# Altium project LCD_KB_Controller.PrjPcb
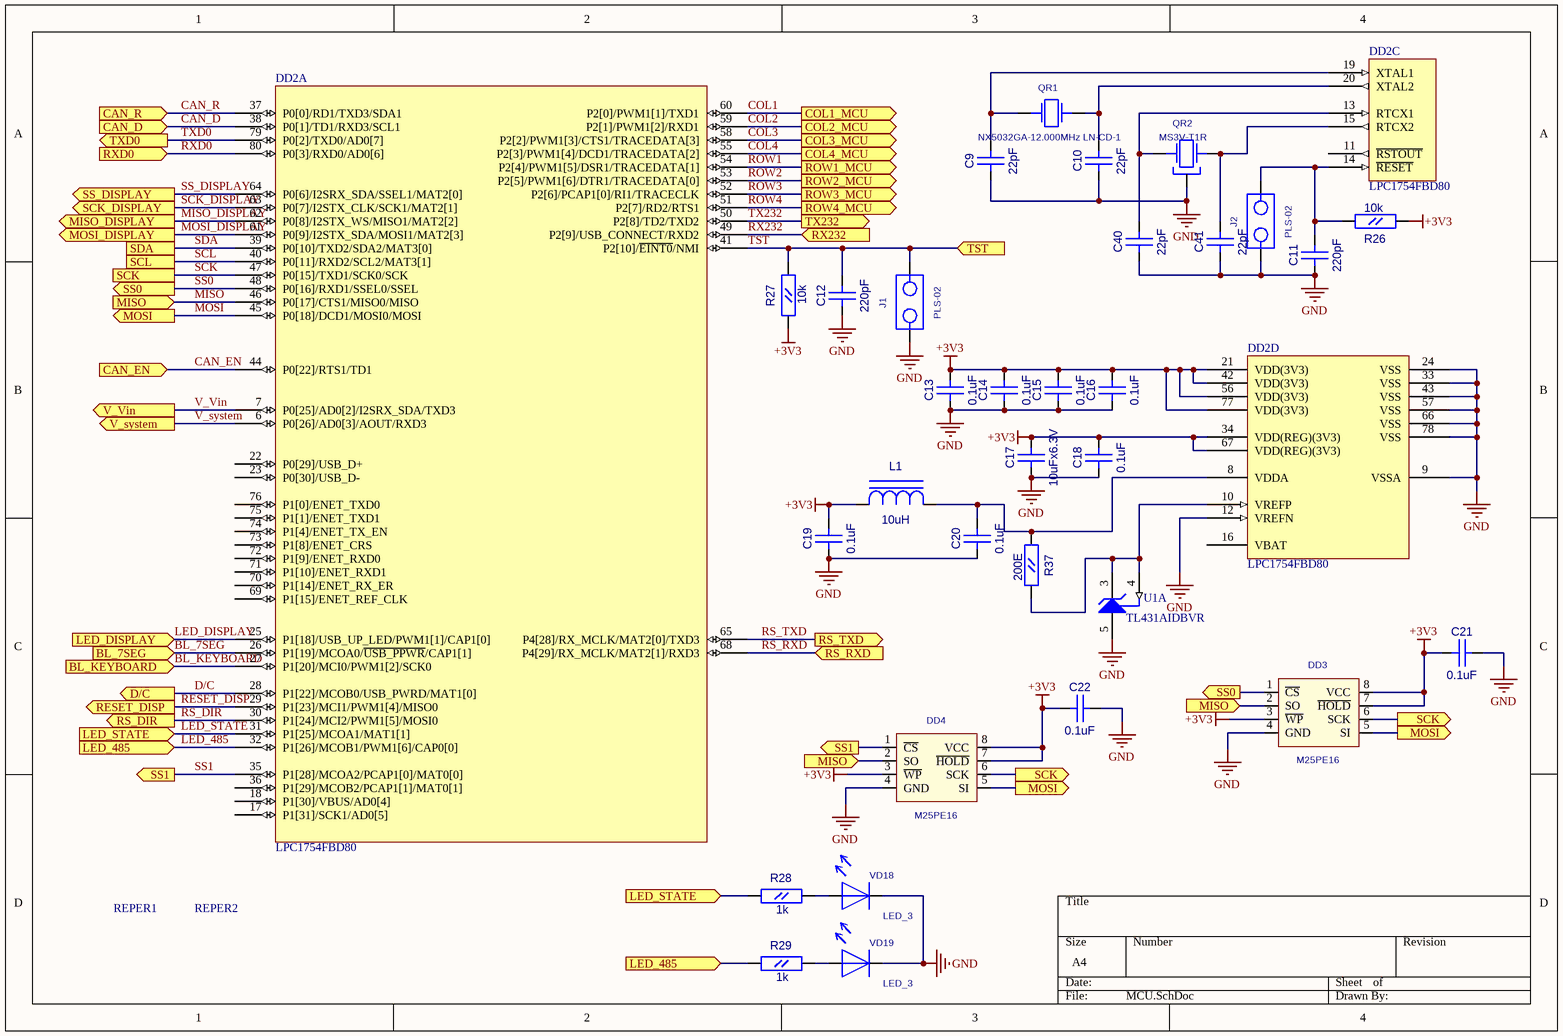
[diagram p0: MCU.SchDoc]
8 sheets, 131 parts. Net scope: flat (ports and power ports of the same name join across sheets).
Board file: LCD_KB_Controller.PcbDoc
Sheets:
  MCU.SchDoc
  Connection.SchDoc
  Power.SchDoc
  Battery.SchDoc
  CAN.SchDoc
  Keyboard.SchDoc
  RS485.SchDoc
  RS232.SchDoc

## Sheet MCU.SchDoc
size A4

### Parts
C9  22pF  [CC0603]
C10  22pF  [CC0603]
C11  220pF  [CC0603]
C12  220pF  [CC0603]
C13  0.1uF  [CC0603]
C14  0.1uF  [CC0603]
C15  0.1uF  [CC0603]
C16  0.1uF  [CC0603]
C17  10uFx6.3V  [CC0805]
C18  0.1uF  [CC0603]
C19  0.1uF  [CC0603]
C20  0.1uF  [CC0603]
C21  0.1uF  [CC0603]
C22  0.1uF  [CC0603]
C40  22pF  [CC0603]
C41  22pF  [CC0603]
DD2  LPC1754FBD80  [TQFP-80_0.5]  (parts A,C,D of 4)
DD3  M25PE16  [EIAJ_SO8]
DD4  M25PE16  [EIAJ_SO8]
J1  PLS-02  [PLS-02]
J2  PLS-02  [PLS-02]
L1  10uH  [L0603]
QR1  NX5032GA-12.000MHz LN-CD-1  [AC5032_2]
QR2  MS3V-T1R  [MS3V-T1R]
R26  10k  [RC0603]
R27  10k  [RC0603]
R28  1k  [RC0603]
R29  1k  [RC0603]
R37  200E  [RC0603]
REPER1  REPER1.2  [REPER1.2]  (value not drawn)
REPER2  REPER1.2  [REPER1.2]  (value not drawn)
U1  TL431AIDBVR  [TI-DBV5_N]  (part A of 2)
VD18  LED_3  [LED3]
VD19  LED_3  [LED3]

### Ports
BL_7SEG (in), BL_KEYBOARD (in), CAN_D (in), CAN_EN (in), CAN_R (in), COL1_MCU (out), COL2_MCU (out), COL3_MCU (out), COL4_MCU (out), D/C (out), LED_485 (in), LED_DISPLAY (in), LED_STATE (in), MISO (in), MISO_DISPLAY (out), MOSI (out), MOSI_DISPLAY (out), RESET_DISP (out), ROW1_MCU (out), ROW2_MCU (out), ROW3_MCU (out), ROW4_MCU (out), RS_DIR (out), RS_RXD (in), RS_TXD (out), RX232 (in), RXD0 (in), SCK, SCK (out), SCK_DISPLAY (out), SCL, SDA, SS0 (out), SS1 (out), SS_DISPLAY (out), TST (in), TX232 (out), TXD0 (out), V_system (out), V_Vin (out)

### Nets
+3V3: C13.2(B) C14.2(B) C15.2(B) C16.2(B) C17.2(B) C18.2(B) C19.2(B) C21.1(A) C22.1(A) DD2.21(VDD(3V3)) DD2.34(VDD(REG)(3V3)) DD2.42(VDD(3V3)) DD2.56(VDD(3V3)) DD2.67(VDD(REG)(3V3)) DD2.77(VDD(3V3)) DD3.3(~{WP}) DD3.7(~{HOLD}) DD3.8(VCC) DD4.3(~{WP}) DD4.7(~{HOLD}) DD4.8(VCC) L1.1(A) R26.1(A) R27.1(A)
GND: C9.1(A) C10.1(A) C11.1(A) C12.1(A) C13.1(A) C14.1(A) C15.1(A) C16.1(A) C17.1(A) C18.1(A) C19.1(A) C20.1(A) C21.2(B) C22.2(B) C40.1(A) C41.1(A) DD2.9(VSSA) DD2.12(VREFN) DD2.24(VSS) DD2.33(VSS) DD2.43(VSS) DD2.57(VSS) DD2.66(VSS) DD2.78(VSS) DD3.4(GND) DD4.4(GND) J1.1 J2.1 QR2.3 U1.5(ANODE) VD18.1 VD19.1
BL_7SEG: DD2.26(P1[19]/MCOA0/~{USB_PPWR}/CAP1[1]) ; port BL_7SEG
BL_KEYBOARD: DD2.27(P1[20]/MCI0/PWM1[2]/SCK0) ; port BL_KEYBOARD
CAN_D: DD2.38(P0[1]/TD1/RXD3/SCL1) ; port CAN_D
CAN_EN: DD2.44(P0[22]/RTS1/TD1) ; port CAN_EN
CAN_R: DD2.37(P0[0]/RD1/TXD3/SDA1) ; port CAN_R
COL1: DD2.60(P2[0]/PWM1[1]/TXD1) ; port COL1_MCU
COL2: DD2.59(P2[1]/PWM1[2]/RXD1) ; port COL2_MCU
COL3: DD2.58(P2[2]/PWM1[3]/CTS1/TRACEDATA[3]) ; port COL3_MCU
COL4: DD2.55(P2[3]/PWM1[4]/DCD1/TRACEDATA[2]) ; port COL4_MCU
D/C: DD2.28(P1[22]/MCOB0/USB_PWRD/MAT1[0]) ; port D/C
LED_485: DD2.32(P1[26]/MCOB1/PWM1[6]/CAP0[0]) R29.1(A) ; port LED_485
LED_DISPLAY: DD2.25(P1[18]/USB_UP_LED/PWM1[1]/CAP1[0]) ; port LED_DISPLAY
LED_STATE: DD2.31(P1[25]/MCOA1/MAT1[1]) R28.1(A) ; port LED_STATE
MISO: DD2.46(P0[17]/CTS1/MISO0/MISO) DD3.2(SO) DD4.2(SO) ; port MISO
MISO_DISPLAY: DD2.62(P0[8]/I2STX_WS/MISO1/MAT2[2]) ; port MISO_DISPLAY
MOSI: DD2.45(P0[18]/DCD1/MOSI0/MOSI) DD3.5(SI) DD4.5(SI) ; port MOSI
MOSI_DISPLAY: DD2.61(P0[9]/I2STX_SDA/MOSI1/MAT2[3]) ; port MOSI_DISPLAY
RESET_DISP: DD2.29(P1[23]/MCI1/PWM1[4]/MISO0) ; port RESET_DISP
ROW1: DD2.54(P2[4]/PWM1[5]/DSR1/TRACEDATA[1]) ; port ROW1_MCU
ROW2: DD2.53(P2[5]/PWM1[6]/DTR1/TRACEDATA[0]) ; port ROW2_MCU
ROW3: DD2.52(P2[6]/PCAP1[0]/RI1/TRACECLK) ; port ROW3_MCU
ROW4: DD2.51(P2[7]/RD2/RTS1) ; port ROW4_MCU
RS_DIR: DD2.30(P1[24]/MCI2/PWM1[5]/MOSI0) ; port RS_DIR
RS_RXD: DD2.68(P4[29]/RX_MCLK/MAT2[1]/RXD3) ; port RS_RXD
RS_TXD: DD2.65(P4[28]/RX_MCLK/MAT2[0]/TXD3) ; port RS_TXD
RX232: DD2.49(P2[9]/USB_CONNECT/RXD2) ; port RX232
RXD0: DD2.80(P0[3]/RXD0/AD0[6]) ; port RXD0
SCK: DD2.47(P0[15]/TXD1/SCK0/SCK) DD3.6(SCK) DD4.6(SCK) ; port SCK
SCK_DISPLAY: DD2.63(P0[7]/I2STX_CLK/SCK1/MAT2[1]) ; port SCK_DISPLAY
SCL: DD2.40(P0[11]/RXD2/SCL2/MAT3[1]) ; port SCL
SDA: DD2.39(P0[10]/TXD2/SDA2/MAT3[0]) ; port SDA
SS0: DD2.48(P0[16]/RXD1/SSEL0/SSEL) DD3.1(~{CS}) ; port SS0
SS1: DD2.35(P1[28]/MCOA2/PCAP1[0]/MAT0[0]) DD4.1(~{CS}) ; port SS1
SS_DISPLAY: DD2.64(P0[6]/I2SRX_SDA/SSEL1/MAT2[0]) ; port SS_DISPLAY
TST: C12.2(B) DD2.41(P2[10]/~{EINT0}/NMI) J1.2 R27.2(B) ; port TST
TX232: DD2.50(P2[8]/TD2/TXD2) ; port TX232
TXD0: DD2.79(P0[2]/TXD0/AD0[7]) ; port TXD0
V_system: DD2.6(P0[26]/AD0[3]/AOUT/RXD3) ; port V_system
V_Vin: DD2.7(P0[25]/AD0[2]/I2SRX_SDA/TXD3) ; port V_Vin
NetC9_2: C9.2(B) DD2.19(XTAL1) QR1.1
NetC10_2: C10.2(B) DD2.20(XTAL2) QR1.2
NetC11_2: C11.2(B) DD2.14(~{RESET}) J2.2 R26.2(B)
NetC20_2: C20.2(B) DD2.8(VDDA) L1.2(C) R37.1(A)
NetC40_2: C40.2(B) DD2.13(RTCX1) QR2.2(X2)
NetC41_2: C41.2(B) DD2.15(RTCX2) QR2.1(X1)
NetDD2_10: DD2.10(VREFP) R37.2(B) U1.3(CATHODE) U1.4(REF)
NetR28_2: R28.2(B) VD18.2
NetR29_2: R29.2(B) VD19.2

Not connected (* = marked no-connect by the designer): DD2 11(~{RSTOUT}) 16(VBAT) 17(P1[31]/SCK1/AD0[5]) 18(P1[30]/VBUS/AD0[4]) 22(P0[29]/USB_D+) 23(P0[30]/USB_D-) 36(P1[29]/MCOB2/PCAP1[1]/MAT0[1]) 69(P1[15]/ENET_REF_CLK) 70(P1[14]/ENET_RX_ER) 71(P1[10]/ENET_RXD1) 72(P1[9]/ENET_RXD0) 73(P1[8]/ENET_CRS) 74(P1[4]/ENET_TX_EN) 75(P1[1]/ENET_TXD1) 76(P1[0]/ENET_TXD0); REPER1 1; REPER2 1

### Library data of the parts
C9-C16 C18-C22 C40 C41 = CC0603
  C9 C10 C40 C41: Value: 22pF
  C11 C12: Value: 220pF
  C13-C16 C18-C22: Value: 0.1uF
C17 = CC0805: Value: 10uFx6.3V
DD2 = LPC1754FBD80: Cortex -M3 32-Bit Microcontroller, 128KB Flash, 64KB RAM, 800-Lead LQFP; ComponentLink1Description: Manufacturer Link; ComponentLink1URL: http://www.nxp.com/
DD3 DD4 = S25FL016A0LMFI01: Value: M25PE16
L1 = L0603: Value: 10uH
QR1 = AC5032_2: AC5032/2; Value: NX5032GA-12.000MHz LN-CD-1
QR2 = MS3V-T1R: CRYSTAL_32768 Hz; Value: *
R26-R29 R37 = RC0603
  R26 R27: Value: 10k
  R28 R29: Value: 1k
  R37: Value: 200E
U1 = TL431AIDBVR: Adjustable Precision Shunt Regulator, 34 ppm / degC, 100 mA, -40 to 85 degC, 5-pin SOT-23 (DBV), Green (RoHS & no Sb/Br); Manufacturer: Texas Instruments; Initial Accuracy @ 25/deg C(%): 1; Iout/Iz(Max)(mA): 100; Min Iz for Regulation(uA): 600; Rating: Catalog; SubFamily: Shunt Voltage Reference; Temp Coeff(Max)(ppm/ degree C): 92; Temp Coeff(Typ)(ppm/ degree C): 34; VO Adj(Max)(V): 36; VO Adj(Min)(V): 2.495; DatasheetVersion: SLVS543M; PackageVersion: 4073253-4/K; PackageReference: DBV5; PackageDescription: 5-Pin Plastic Small Outline, Body 1.60 Ч 2.90 mm, Pitch 0.95 mm; Supplier 1: Digi-Key; Supplier Part Number 1: 296-15237-2-ND; Supplier 2: Digi-Key; Supplier Part Number 2: 296-15237-1-ND; Supplier 3: Digi-Key; Supplier Part Number 3: 296-15237-6-ND; Supplier 4: Newark; Supplier Part Number 4: 61H5522; Supplier 5: Mouser; Supplier Part Number 5: 595-TL431AIDBVR; Eco-Plan: Green (RoHS & no Sb/Br); Mounting Technology: Surface Mount; Code_JEDEC: MO-178; PartNumber: TL431AIDBVR; ComponentLink1Description: Manufacturer URL; ComponentLink1URL: http://www.ti.com/; ComponentLink2Description: Datasheet; ComponentLink2URL: http://www.ti.com/general/docs/lit/getliterature.tsp?genericPartNumber=TL431A&fileType=pdf; ComponentLink3Description: Package Specification; ComponentLink3URL: http://www.ti.com/litv/pdf/mpds018i; ComponentLink4Description: URL Link1; ComponentLink4URL: Samples URL:http://www.ti.com/product/tl431a
J1 J2 = PLS-02: Value: *
REPER1 REPER2 = REPER1.2: Value: *
VD18 VD19 = LED_3: Value: *

## Sheet Connection.SchDoc
size A4
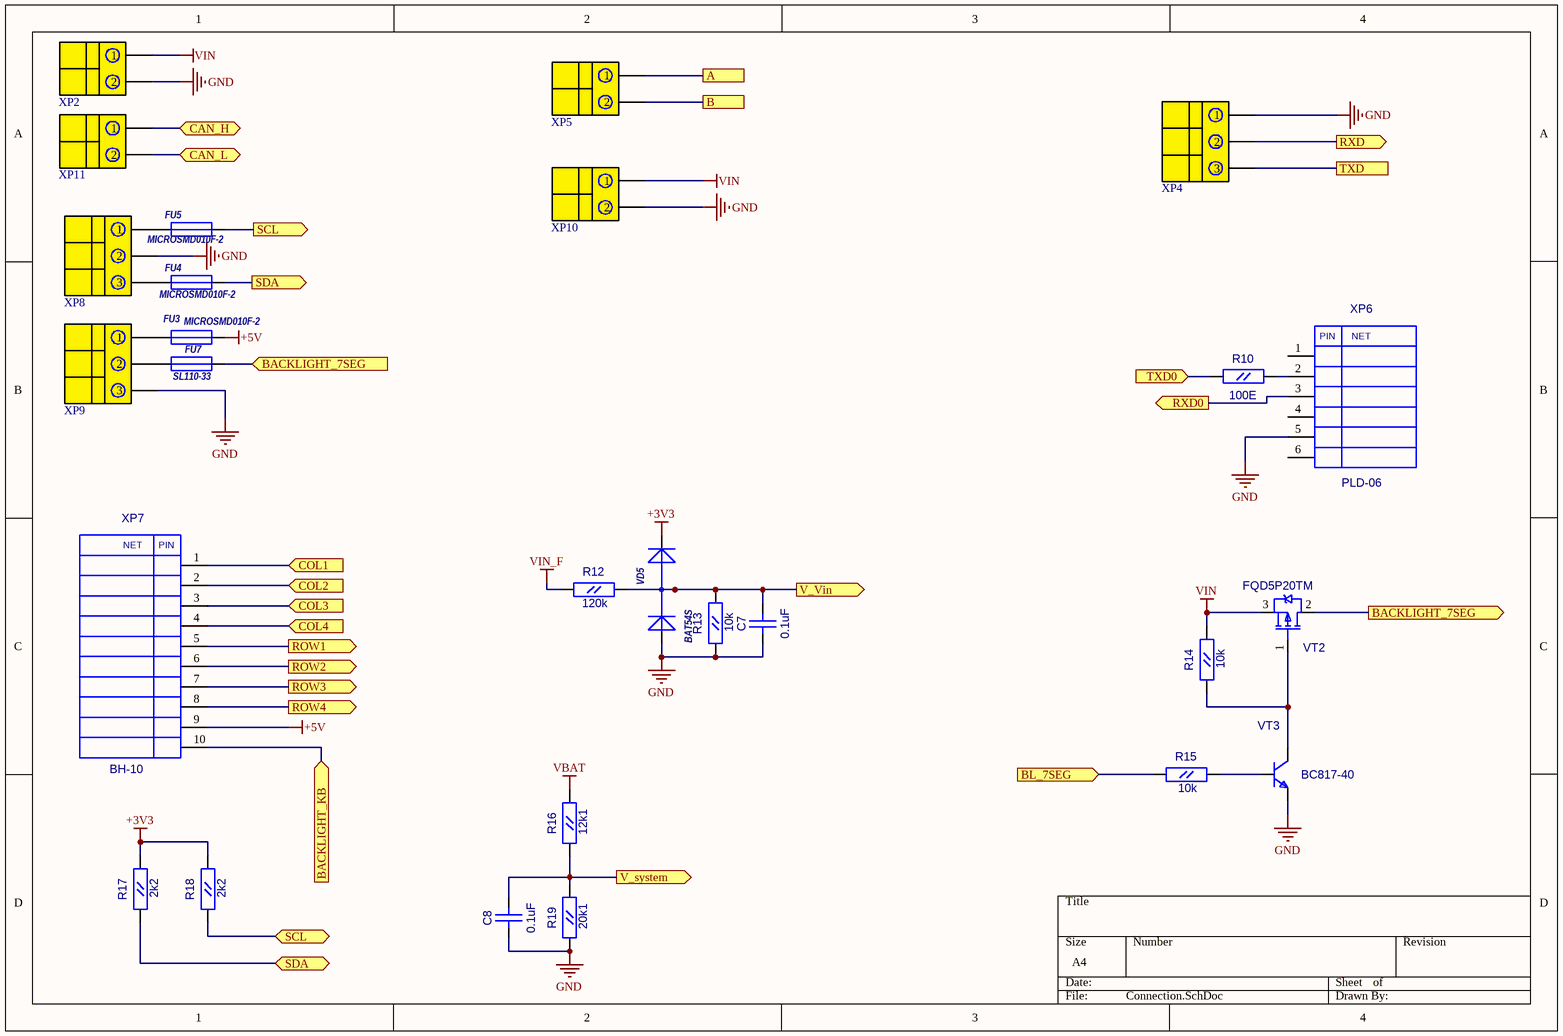
[diagram p1: Connection.SchDoc]

### Parts
C7  0.1uF  [CC0603]
C8  0.1uF  [CC0603]
FU3  MICROSMD010F-2  [RC1210]
FU4  MICROSMD010F-2  [RC1210]
FU5  MICROSMD010F-2  [RC1210]
FU7  SL110-33  [FSMD2920]
R10  100E  [RC0603]
R12  120k  [RC0603]
R13  10k  [RC0603]
R14  10k  [RC0603]
R15  10k  [RC0603]
R16  12k1  [RC0603]
R17  2k2  [RC0603]
R18  2k2  [RC0603]
R19  20k1  [RC0603]
VD5  BAT54S  [SOT-23(GSD)]
VT2  FQD5P20TM  [D-PAK(TO-252AA)]
VT3  BC817-40  [SOT-23(123)]
XP2  DG330-2PIN  [DG330-2PIN]  (value not drawn)
XP4  DG330-3P  [DG330-3PIN]  (value not drawn)
XP5  DG330-2PIN  [DG330-2PIN]  (value not drawn)
XP6  PLD-06  [PIN6]
XP7  BH-10  [BH-10]
XP8  DG330-3PIN  [DG330-3PIN]  (value not drawn)
XP9  DG330-3PIN  [DG330-3PIN]  (value not drawn)
XP10  DG330-2PIN  [DG330-2PIN]  (value not drawn)
XP11  DG330-2PIN  [DG330-2PIN]  (value not drawn)

### Ports
A, B, BACKLIGHT_7SEG (in), BACKLIGHT_7SEG (out), BACKLIGHT_KB (in), BL_7SEG (in), CAN_H (bidir), CAN_L (bidir), COL1 (in), COL2 (in), COL3 (in), COL4 (in), ROW1 (out), ROW2 (out), ROW3 (out), ROW4 (out), RXD0 (out), RXD (out), SCL (bidir), SCL (out), SDA (bidir), SDA (out), TXD, TXD0 (in), V_system (out), V_Vin (out)

### Nets
+3V3: R17.2(B) R18.2(B) VD5.2(K)
+5V: FU3.2 XP7.9
GND: C7.1(A) C8.1(A) R13.1(A) R19.1(A) VD5.1(A) VT3.2(E) XP2.2 XP4.1 XP6.5 XP8.2 XP9.3 XP10.2
VBAT: R16.2(B)
VIN: R14.2(B) VT2.3(S) XP2.1 XP10.1
VIN_F: R12.1(A)
BL_7SEG: R15.1(A) ; port BL_7SEG
CANH: XP11.1 ; port CAN_H
CANL: XP11.2 ; port CAN_L
ROW1: XP7.5 ; port ROW1
ROW2: XP7.6 ; port ROW2
ROW3: XP7.7 ; port ROW3
ROW4: XP7.8 ; port ROW4
RXD: XP4.2 ; port RXD
RXD0: XP6.3 ; port RXD0
SCL: FU5.2 R18.1(A) ; port SCL
SDA: FU4.2 R17.1(A) ; port SDA
TXD0: R10.1(A) ; port TXD0
V_system: C8.2(B) R16.1(A) R19.2(B) ; port V_system
V_Vin: C7.2(B) R12.2(B) R13.2(B) VD5.3(AK) ; port V_Vin
NetFU3_1: FU3.1 XP9.1
NetFU4_1: FU4.1 XP8.3
NetFU5_1: FU5.1 XP8.1
NetFU6_2: XP4.3 ; port TXD
NetFU7_1: FU7.1 XP9.2
NetFU7_2: FU7.2 VT2.2(D) ; port BACKLIGHT_7SEG
NetFU8_2: XP5.2 ; port B
NetFU9_2: XP5.1 ; port A
NetR10_2: R10.2(B) XP6.2
NetR14_1: R14.1(A) VT2.1(G) VT3.3(C)
NetR15_2: R15.2(B) VT3.1(B)
NetVD6_1: XP7.1 ; port COL1
NetVD7_1: XP7.3 ; port COL3
NetVD10_1: XP7.2 ; port COL2
NetVD11_1: XP7.4 ; port COL4
NetVT5_3: XP7.10 ; port BACKLIGHT_KB

Not connected (* = marked no-connect by the designer): XP6 1 4 6

### Notes on the sheet
- (in symbol BH-10) NET; PIN
- (in symbol PLD-06) PIN; NET

### Library data of the parts
C7 C8 = CC0603: Value: 0.1uF
FU3-FU5 = MICROSMD: Value: MICROSMD010F-2
FU7 = FSMD2920: FSMD150-2920; Value: *
R10 R12-R19 = RC0603
  R10: Value: 100E
  R12: Value: 120k
  R13-R15: Value: 10k
  R16: Value: 12k1
  R17 R18: Value: 2k2
  R19: Value: 20k1
VD5 = BAT54S: 1.0 Ampere General Purpose Rectifier; ComponentField6: Published 8-Jun-2000, Modified 11-July-2000: SIM Model Added.; Value: *
VT2 = IRFR9220: HEXFET Power MOSFET; OriginalName: IRLML5103; ComponentField7: Published 8-Jun-2000; Value: FQD5P20TM
VT3 = BC846BLT1: NPN 500ma transistor; ComponentField7: Published 29-Sep-2000; OriginalName: BC846BLT1; Value: BC817-40
XP4 = DG330-3PIN: Value: DG330-3P
XP6 = PLD-06: PLD06; Value: *
XP2 XP5 XP10 XP11 = DG330-2PIN: Value: DG330-2PIN
XP7 = BH-10: Value: *
XP8 XP9 = DG330-3PIN: Value: DG330-3PIN

## Sheet Power.SchDoc
size A4
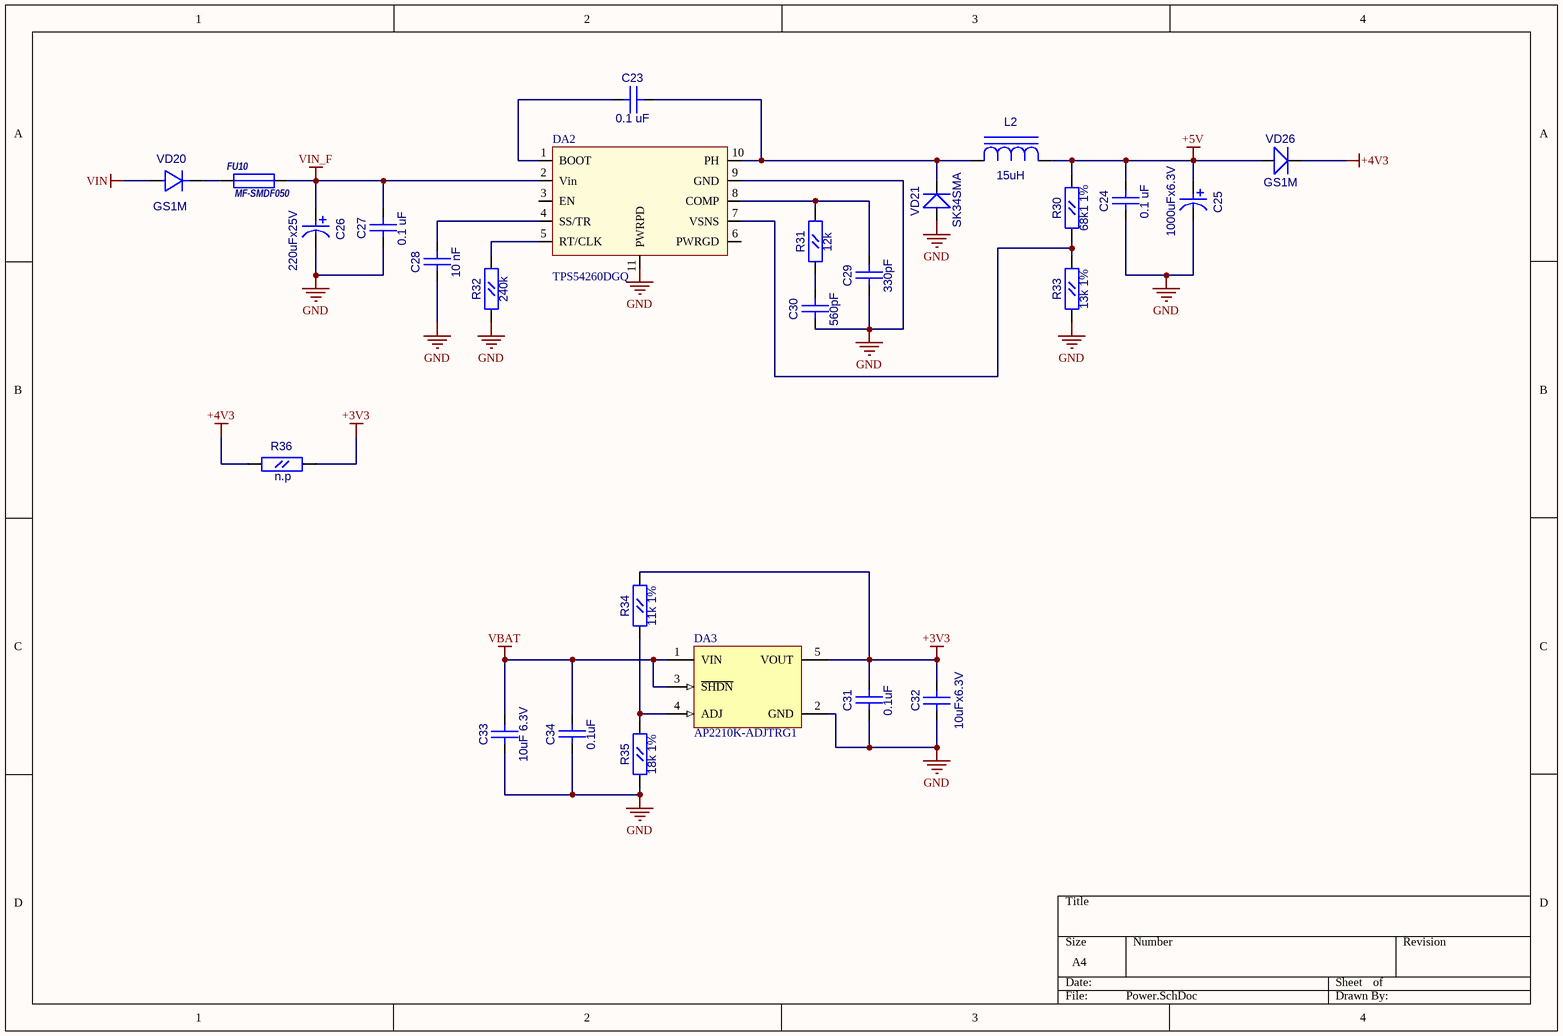
[diagram p2: Power.SchDoc]

### Parts
C23  0.1 uF  [CC0603]
C24  0.1 uF  [CC0603]
C25  1000uFx6.3V  [CC8X3.5]
C26  220uFx25V  [CC8X3.5]
C27  0.1 uF  [CC0603]
C28  10 nF  [CC0603]
C29  330pF  [CC0603]
C30  560pF  [CC0603]
C31  0.1uF  [CC0603]
C32  10uFx6.3V  [CC0805]
C33  10uF 6.3V  [CC0805]
C34  0.1uF  [CC0603]
DA2  TPS54260DGQ  [S-PDSO-G10]
DA3  AP2210K-ADJTRG1  [SOT23-5]
FU10  MF-SMDF050  [MF-SMDF]
L2  15uH  [SDR0805]
R30  68k1 1%  [RC0603]
R31  12k  [RC0603]
R32  240k  [RC0603]
R33  13k 1%  [RC0603]
R34  11k 1%  [RC0603]
R35  18k 1%  [RC0603]
R36  n.p  [RC0805]
VD20  GS1M  [SMA]
VD21  SK34SMA  [SMA]
VD26  GS1M  [SMA]

### Nets
+3V3: C31.1(A) C32.2(B) DA3.5(VOUT) R34.2(B) R36.2(B)
+4V3: R36.1(A) VD26.2(K)
+5V: C24.1(A) C25.1 L2.2(A) R30.2(B) VD26.1(A)
GND: C24.2(B) C25.2 C26.2 C27.2(B) C28.2(B) C29.2(B) C30.2(B) C31.2(B) C32.1(A) C33.1(A) C34.2(B) DA2.9(GND) DA2.11(PWRPD) DA3.2(GND) R32.1(A) R33.1(A) R35.1(A) VD21.1(A)
VBAT: C33.2(B) C34.1(A) DA3.1(VIN) DA3.3(~{SHDN})
VIN: VD20.1(A)
VIN_F: C26.1 C27.1(A) DA2.2(Vin) FU10.2
NetC23_1: C23.1(A) DA2.10(PH) L2.1(C) VD21.2(K)
NetC23_2: C23.2(B) DA2.1(BOOT)
NetC28_1: C28.1(A) DA2.4(SS/TR)
NetC29_1: C29.1(A) DA2.8(COMP) R31.2(B)
NetC30_1: C30.1(A) R31.1(A)
NetDA2_5: DA2.5(RT/CLK) R32.2(B)
NetDA2_7: DA2.7(VSNS) R30.1(A) R33.2(B)
NetDA3_4: DA3.4(ADJ) R34.1(A) R35.2(B)
NetFU10_1: FU10.1 VD20.2(K)

Not connected (* = marked no-connect by the designer): DA2 3(EN) 6(PWRGD)

### Library data of the parts
C23 C24 C27-C31 C34 = CC0603
  C23 C24 C27: Value: 0.1 uF
  C28: Value: 10 nF
  C29: Value: 330pF
  C30: Value: 560pF
  C31 C34: Value: 0.1uF
C25 C26 = CAP0.35
  C25: Value: 1000uFx6.3V
  C26: Value: 220uFx25V
C32 C33 = CC0805
  C32: Value: 10uFx6.3V
  C33: Value: 10uF 6.3V
DA3 = MCP1824T-ADJE/OT: 300 mA, Low Voltage, Low Quiescent Current LDO Regulator, 5-Pin SOT-223, Extended Temperature, Tape and Reel; Published: 29-Jan-2009; DatasheetVersion: revA, Aug-2007; PackageVersion: revAW, Oct-2008; PackageReference: SOT-223-DC5; Publisher: Altium Limited; PackageDescription: 5-Lead Plastic Small Outline Transistor (DC) [SOT-223]; ComponentLink1Description: Manufacturer Link; ComponentLink1URL: http://www.microchip.com; ComponentLink2Description: Datasheet; ComponentLink2URL: http://ww1.microchip.com/downloads/en/DeviceDoc/22070a.pdf; ComponentLink3Description: Packaging Specification; ComponentLink3URL: http://ww1.microchip.com/downloads/en/PackagingSpec/00049AW.pdf
FU10 = MF-SMDF: Value: *
L2 = SDR0805: Value: 15uH
R30-R35 = RC0603
  R30: Value: 68k1 1%
  R31: Value: 12k
  R32: Value: 240k
  R33: Value: 13k 1%
  R34: Value: 11k 1%
  R35: Value: 18k 1%
R36 = RC0805: Value: n.p
VD20 = GS1M: Value: {Value}
VD21 = SK34SMA: Schottky Rectifier; Value: {Value}
VD26 = SS14: Schottky Rectifier; OriginalName: 10BQ100; ComponentField6: Published 8-Jun-2000, Modified 10-July-2000: SIM Model Added.; Value: GS1M

## Sheet Battery.SchDoc
size A4
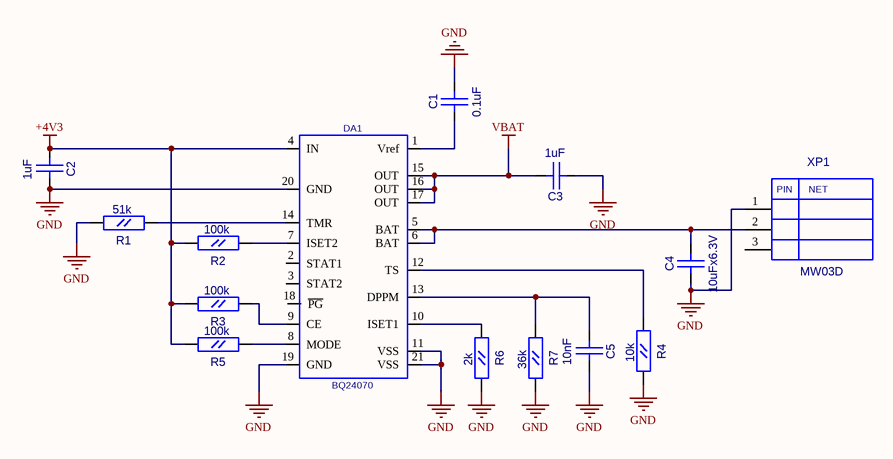
[diagram p3: Battery.SchDoc]

### Parts
C1  0.1uF  [CC0603]
C2  1uF  [CC0603]
C3  1uF  [CC0603]
C4  10uFx6.3V  [CC0805]
C5  10nF  [CC0603]
DA1  BQ24070  [P-PQFP-N20]
R1  51k  [RC0603]
R2  100k  [RC0603]
R3  100k  [RC0603]
R4  10k  [RC0603]
R5  100k  [RC0603]
R6  2k  [RC0603]
R7  36k  [RC0603]
XP1  MW03D  [MW03D]

### Nets
+4V3: C2.1(A) DA1.4(IN) R2.2(B) R3.2(B) R5.2(B)
GND: C1.2(B) C2.2(B) C3.1(A) C4.1(A) C5.2(B) DA1.11(VSS) DA1.19(GND) DA1.20(GND) DA1.21(VSS) R1.2(B) R4.2(B) R6.2(B) R7.2(B) XP1.1
VBAT: C3.2(B) DA1.15(OUT) DA1.16(OUT) DA1.17(OUT)
NetC1_1: C1.1(A) DA1.1(Vref)
NetC4_2: C4.2(B) DA1.5(BAT) DA1.6(BAT) XP1.2
NetC5_1: C5.1(A) DA1.13(DPPM) R7.1(A)
NetDA1_7: DA1.7(ISET2) R2.1(A)
NetDA1_8: DA1.8(MODE) R5.1(A)
NetDA1_9: DA1.9(CE) R3.1(A)
NetDA1_10: DA1.10(ISET1) R6.1(A)
NetDA1_12: DA1.12(TS) R4.1(A)
NetDA1_14: DA1.14(TMR) R1.1(A)

Not connected (* = marked no-connect by the designer): DA1 2(STAT1) 3(STAT2) 18(~{PG}); XP1 3

### Notes on the sheet
- (in symbol MW03D) PIN; NET

### Library data of the parts
C1-C3 C5 = CC0603
  C1: Value: 0.1uF
  C2 C3: Value: 1uF
  C5: Value: 10nF
C4 = CC0805: Value: 10uFx6.3V
R1-R7 = RC0603
  R1: Value: 51k
  R2 R3 R5: Value: 100k
  R4: Value: 10k
  R6: Value: 2k
  R7: Value: 36k
DA1 = BQ24070: Value: *
XP1 = MW03D: Value: *

## Sheet CAN.SchDoc
size A4
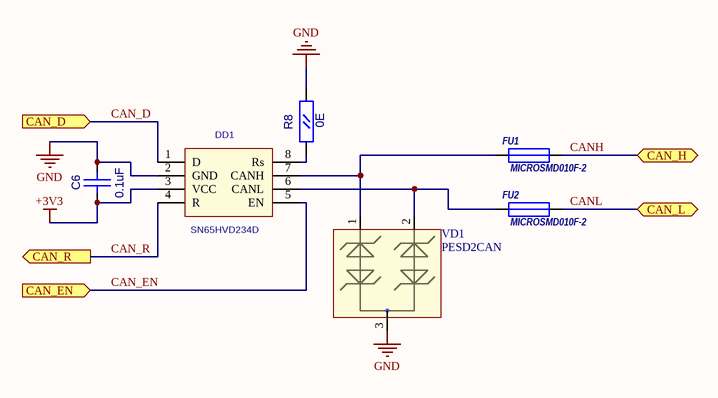
[diagram p4: CAN.SchDoc]

### Parts
C6  0.1uF  [CC0603]
DD1  SN65HVD234D  [SO-8]
FU1  MICROSMD010F-2  [RC1210]
FU2  MICROSMD010F-2  [RC1210]
R8  0E  [RC0603]
VD1  PESD2CAN  [SOT-23(123)]

### Ports
CAN_D (in), CAN_EN (in), CAN_H (bidir), CAN_L (bidir), CAN_R (out)

### Nets
+3V3: C6.1(A) DD1.3(VCC)
GND: C6.2(B) DD1.2(GND) R8.2(B) VD1.3
CAN_D: DD1.1(D) ; port CAN_D
CAN_EN: DD1.5(EN) ; port CAN_EN
CAN_R: DD1.4(R) ; port CAN_R
CANH: FU1.2 ; port CAN_H
CANL: FU2.2 ; port CAN_L
NetDD1_6: DD1.6(CANL) FU2.1 VD1.2
NetDD1_7: DD1.7(CANH) FU1.1 VD1.1
NetDD1_8: DD1.8(Rs) R8.1(A)

### Library data of the parts
C6 = CC0603: Value: 0.1uF
DD1 = SN65HVD234D: CAN Transceiver; Value: *
FU1 FU2 = MICROSMD: Value: MICROSMD010F-2
R8 = RC0603: Value: 0E
VD1 = PESD2CAN: TVS for CAN

## Sheet Keyboard.SchDoc
size A4
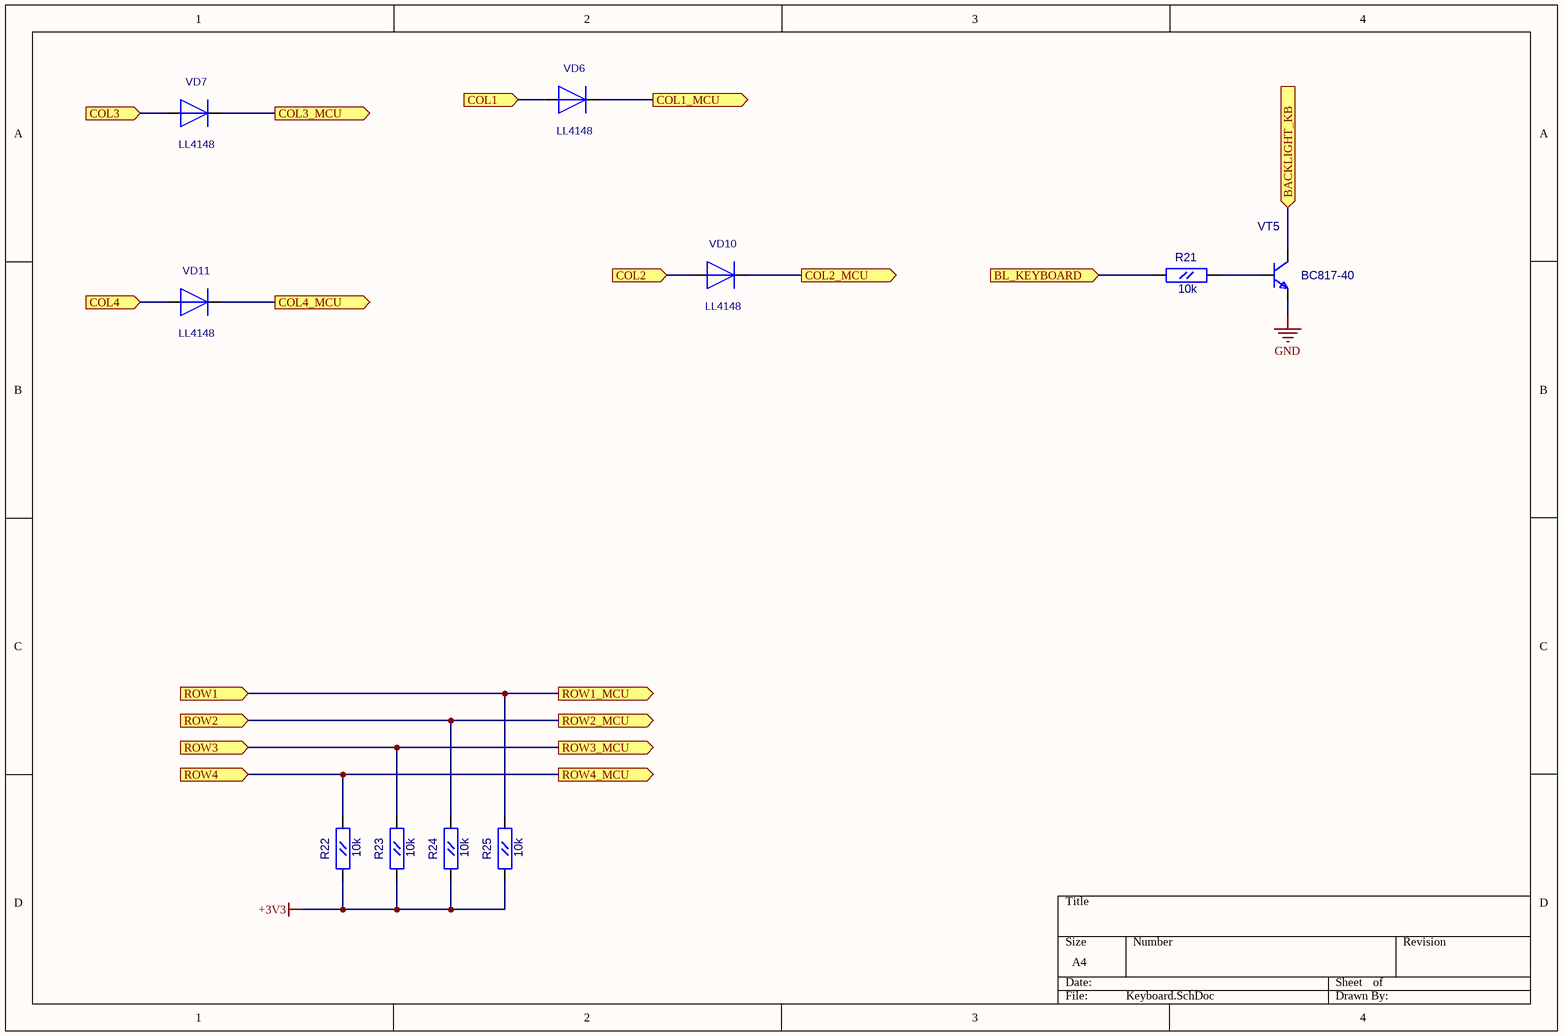
[diagram p5: Keyboard.SchDoc]

### Parts
R21  10k  [RC0603]
R22  10k  [RC0603]
R23  10k  [RC0603]
R24  10k  [RC0603]
R25  10k  [RC0603]
VD6  LL4148  [SOD-80]
VD7  LL4148  [SOD-80]
VD10  LL4148  [SOD-80]
VD11  LL4148  [SOD-80]
VT5  BC817-40  [SOT-23(123)]

### Ports
BACKLIGHT_KB (in), BL_KEYBOARD (in), COL1 (in), COL1_MCU (out), COL2 (in), COL2_MCU (out), COL3 (in), COL3_MCU (out), COL4 (in), COL4_MCU (out), ROW1 (in), ROW1_MCU (out), ROW2 (in), ROW2_MCU (out), ROW3 (in), ROW3_MCU (out), ROW4 (in), ROW4_MCU (out)

### Nets
+3V3: R22.1(A) R23.1(A) R24.1(A) R25.1(A)
GND: VT5.2(E)
BL_KEYBOARD: R21.1(A) ; port BL_KEYBOARD
COL1: VD6.2(+) ; port COL1_MCU
COL2: VD10.2(+) ; port COL2_MCU
COL3: VD7.2(+) ; port COL3_MCU
COL4: VD11.2(+) ; port COL4_MCU
ROW1: R25.2(B) ; port ROW1_MCU, port ROW1
ROW2: R24.2(B) ; port ROW2_MCU, port ROW2
ROW3: R23.2(B) ; port ROW3_MCU, port ROW3
ROW4: R22.2(B) ; port ROW4_MCU, port ROW4
NetR21_2: R21.2(B) VT5.1(B)
NetVD6_1: VD6.1(-) ; port COL1
NetVD7_1: VD7.1(-) ; port COL3
NetVD10_1: VD10.1(-) ; port COL2
NetVD11_1: VD11.1(-) ; port COL4
NetVT5_3: VT5.3(C) ; port BACKLIGHT_KB

### Library data of the parts
R21-R25 = RC0603: Value: 10k
VT5 = BC846BLT1: as VT3 on sheet Connection; OriginalName: BC846BLT1; Value: BC817-40
VD6 VD7 VD10 VD11 = LL4148: Value: *

## Sheet RS485.SchDoc
size A4
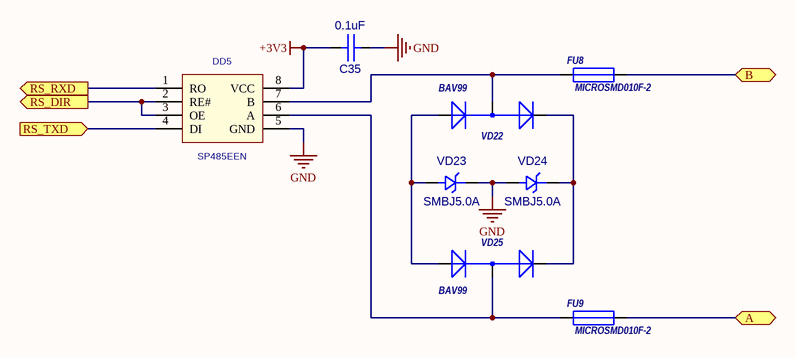
[diagram p6: RS485.SchDoc]

### Parts
C35  0.1uF  [CC0603]
DD5  SP485EEN  [SO-8]
FU8  MICROSMD010F-2  [RC1210]
FU9  MICROSMD010F-2  [RC1210]
VD22  BAV99  [SOT-23(GSD)]
VD23  SMBJ5.0A  [SMB]
VD24  SMBJ5.0A  [SMB]
VD25  BAV99  [SOT-23(GSD)]

### Ports
A, B, RS_DIR (out), RS_RXD (out), RS_TXD (in)

### Nets
+3V3: C35.2(B) DD5.8(VCC)
GND: C35.1(A) DD5.5(GND) VD23.2(K) VD24.1(A)
RS_DIR: DD5.2(RE#) DD5.3(OE) ; port RS_DIR
RS_RXD: DD5.1(RO) ; port RS_RXD
RS_TXD: DD5.4(DI) ; port RS_TXD
NetDD5_6: DD5.6(A) FU9.1 VD25.3(AK)
NetDD5_7: DD5.7(B) FU8.1 VD22.3(AK)
NetFU8_2: FU8.2 ; port B
NetFU9_2: FU9.2 ; port A
NetVD22_1: VD22.1(A) VD23.1(A) VD25.1(A)
NetVD22_2: VD22.2(K) VD24.2(K) VD25.2(K)

### Library data of the parts
C35 = CC0603: Value: 0.1uF
DD5 = SP485: Value: *
FU8 FU9 = MICROSMD: Value: MICROSMD010F-2
VD22 VD25 = BAV99: 1.0 Ampere General Purpose Rectifier; ComponentField6: Published 8-Jun-2000, Modified 11-July-2000: SIM Model Added.; Value: *
VD23 VD24 = SMBJ: Value: SMBJ5.0A

## Sheet RS232.SchDoc
size A4
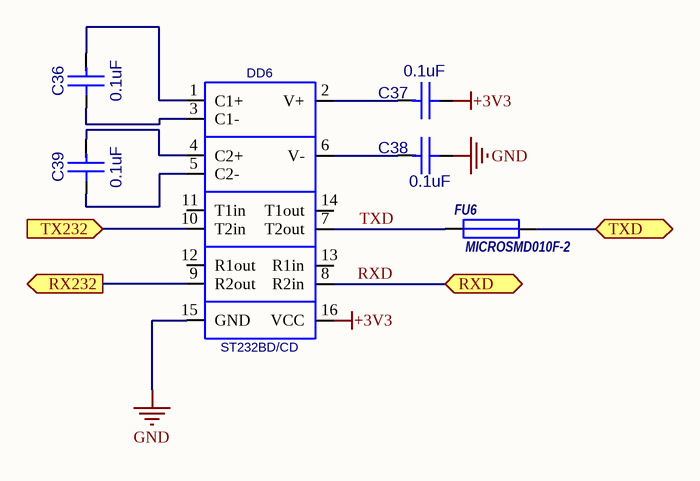
[diagram p7: RS232.SchDoc]

### Parts
C36  0.1uF  [CC0603]
C37  0.1uF  [CC0603]
C38  0.1uF  [CC0603]
C39  0.1uF  [CC0603]
DD6  ST232BD/CD  [SO16_M]
FU6  MICROSMD010F-2  [RC1210]

### Ports
RX232 (out), RXD, TX232 (in), TXD

### Nets
+3V3: C37.1(A) DD6.16(VCC)
GND: C38.1(A) DD6.15(GND)
RX232: DD6.9(R2out) ; port RX232
RXD: DD6.8(R2in) ; port RXD
TX232: DD6.10(T2in) ; port TX232
TXD: DD6.7(T2out) FU6.1
NetC36_1: C36.1(A) DD6.3(C1-)
NetC36_2: C36.2(B) DD6.1(C1+)
NetC37_2: C37.2(B) DD6.2(V+)
NetC38_2: C38.2(B) DD6.6(V-)
NetC39_1: C39.1(A) DD6.5(C2-)
NetC39_2: C39.2(B) DD6.4(C2+)
NetFU6_2: FU6.2 ; port TXD

Not connected (* = marked no-connect by the designer): DD6 11(T1in) 12(R1out) 13(R1in) 14(T1out)

### Library data of the parts
C36-C39 = CC0603: Value: 0.1uF
FU6 = MICROSMD: Value: MICROSMD010F-2
DD6 = ST232BD/CD: Value: *

## Nets that join several sheets
+3V3: MCU (24 pins), Connection (R17.2 R18.2 VD5.2), Power (5 pins), CAN (C6.1 DD1.3), Keyboard (R22.1 R23.1 R24.1 R25.1), RS485 (C35.2 DD5.8), RS232 (C37.1 DD6.16)
+4V3: Power (R36.1 VD26.2), Battery (5 pins)
+5V: Connection (FU3.2 XP7.9), Power (5 pins)
GND: MCU (32 pins), Connection (12 pins), Power (18 pins), Battery (14 pins), CAN (C6.2 DD1.2 R8.2 VD1.3), Keyboard (VT5.2), RS485 (C35.1 DD5.5 VD23.2 VD24.1), RS232 (C38.1 DD6.15)
VBAT: Connection (R16.2), Power (C33.2 C34.1 DA3.1 DA3.3), Battery (C3.2 DA1.15 DA1.16 DA1.17)
VIN: Connection (R14.2 VT2.3 XP2.1 XP10.1), Power (VD20.1)
VIN_F: Connection (R12.1), Power (C26.1 C27.1 DA2.2 FU10.2)
BL_7SEG: MCU (DD2.26), Connection (R15.1)
BL_KEYBOARD: MCU (DD2.27), Keyboard (R21.1)
CAN_D: MCU (DD2.38), CAN (DD1.1)
CAN_EN: MCU (DD2.44), CAN (DD1.5)
CAN_R: MCU (DD2.37), CAN (DD1.4)
CANH: Connection (XP11.1), CAN (FU1.2)
CANL: Connection (XP11.2), CAN (FU2.2)
COL1: MCU (DD2.60), Keyboard (VD6.2)
COL2: MCU (DD2.59), Keyboard (VD10.2)
COL3: MCU (DD2.58), Keyboard (VD7.2)
COL4: MCU (DD2.55), Keyboard (VD11.2)
NetFU6_2: Connection (XP4.3), RS232 (FU6.2)
NetFU8_2: Connection (XP5.2), RS485 (FU8.2)
NetFU9_2: Connection (XP5.1), RS485 (FU9.2)
NetVD6_1: Connection (XP7.1), Keyboard (VD6.1)
NetVD7_1: Connection (XP7.3), Keyboard (VD7.1)
NetVD10_1: Connection (XP7.2), Keyboard (VD10.1)
NetVD11_1: Connection (XP7.4), Keyboard (VD11.1)
NetVT5_3: Connection (XP7.10), Keyboard (VT5.3)
ROW1: MCU (DD2.54), Connection (XP7.5), Keyboard (R25.2)
ROW2: MCU (DD2.53), Connection (XP7.6), Keyboard (R24.2)
ROW3: MCU (DD2.52), Connection (XP7.7), Keyboard (R23.2)
ROW4: MCU (DD2.51), Connection (XP7.8), Keyboard (R22.2)
RS_DIR: MCU (DD2.30), RS485 (DD5.2 DD5.3)
RS_RXD: MCU (DD2.68), RS485 (DD5.1)
RS_TXD: MCU (DD2.65), RS485 (DD5.4)
RX232: MCU (DD2.49), RS232 (DD6.9)
RXD: Connection (XP4.2), RS232 (DD6.8)
RXD0: MCU (DD2.80), Connection (XP6.3)
SCL: MCU (DD2.40), Connection (FU5.2 R18.1)
SDA: MCU (DD2.39), Connection (FU4.2 R17.1)
TX232: MCU (DD2.50), RS232 (DD6.10)
TXD0: MCU (DD2.79), Connection (R10.1)
V_system: MCU (DD2.6), Connection (C8.2 R16.1 R19.2)
V_Vin: MCU (DD2.7), Connection (C7.2 R12.2 R13.2 VD5.3)